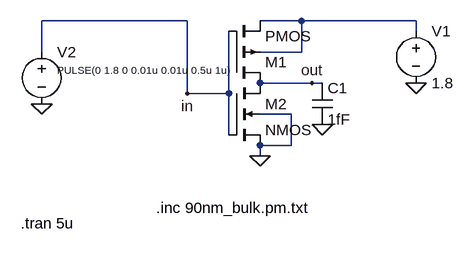
[diagram p0: schematic conv-trans.asc]
conv-trans.asc, the LTspice schematic file:
Version 4
SHEET 1 880 680
WIRE 96 -32 -128 -32
WIRE 272 -32 208 -32
WIRE 448 -32 272 -32
WIRE 448 -16 448 -32
WIRE -128 16 -128 -32
WIRE 272 16 272 -32
WIRE 272 16 208 16
WIRE 288 64 208 64
WIRE 304 64 288 64
WIRE 96 80 96 -32
WIRE 160 80 160 -16
WIRE 160 80 96 80
WIRE 256 112 208 112
WIRE 160 144 160 80
WIRE 256 160 256 112
WIRE 256 160 208 160
WIRE 208 176 208 160
FLAG 448 64 0
FLAG 288 64 out
FLAG 96 80 in
FLAG 208 176 0
FLAG 304 128 0
FLAG -128 96 0
SYMBOL voltage 448 -32 R0
WINDOW 123 0 0 Left 0
WINDOW 39 0 0 Left 0
SYMATTR InstName V1
SYMATTR Value 1.8
SYMBOL pmos4 160 64 M180
SYMATTR InstName M1
SYMATTR Value2 l=100n w=330n
SYMBOL nmos4 160 64 R0
SYMATTR InstName M2
SYMATTR Value2 l=100n w=120n
SYMBOL cap 288 64 R0
SYMATTR InstName C1
SYMATTR Value 1fF
SYMBOL voltage -128 0 R0
WINDOW 3 24 44 Left 1
WINDOW 123 0 0 Left 0
WINDOW 39 0 0 Left 0
SYMATTR Value PULSE(0 1.8 0 0.01u 0.01u 0.5u 1u)
SYMATTR InstName V2
TEXT 48 256 Left 2 !.inc 90nm_bulk.pm.txt
TEXT -160 280 Left 2 !.tran 5u

The netlist it stands for:
* conv-trans.asc
V1 N001 0 1.8
M1 out in N001 N001 PMOS l=100n w=330n
M2 out in 0 0 NMOS l=100n w=120n
C1 out 0 1fF
V2 in 0 PULSE(0 1.8 0 0.01u 0.01u 0.5u 1u)
.model NMOS NMOS
.model PMOS PMOS
.lib standard.mos
.inc 90nm_bulk.pm.txt
.tran 5u
.backanno
.end